# Altium schematic sheet 04_excitation.SchDoc
size A3; SheetNumber: 16; SheetTotal: 17
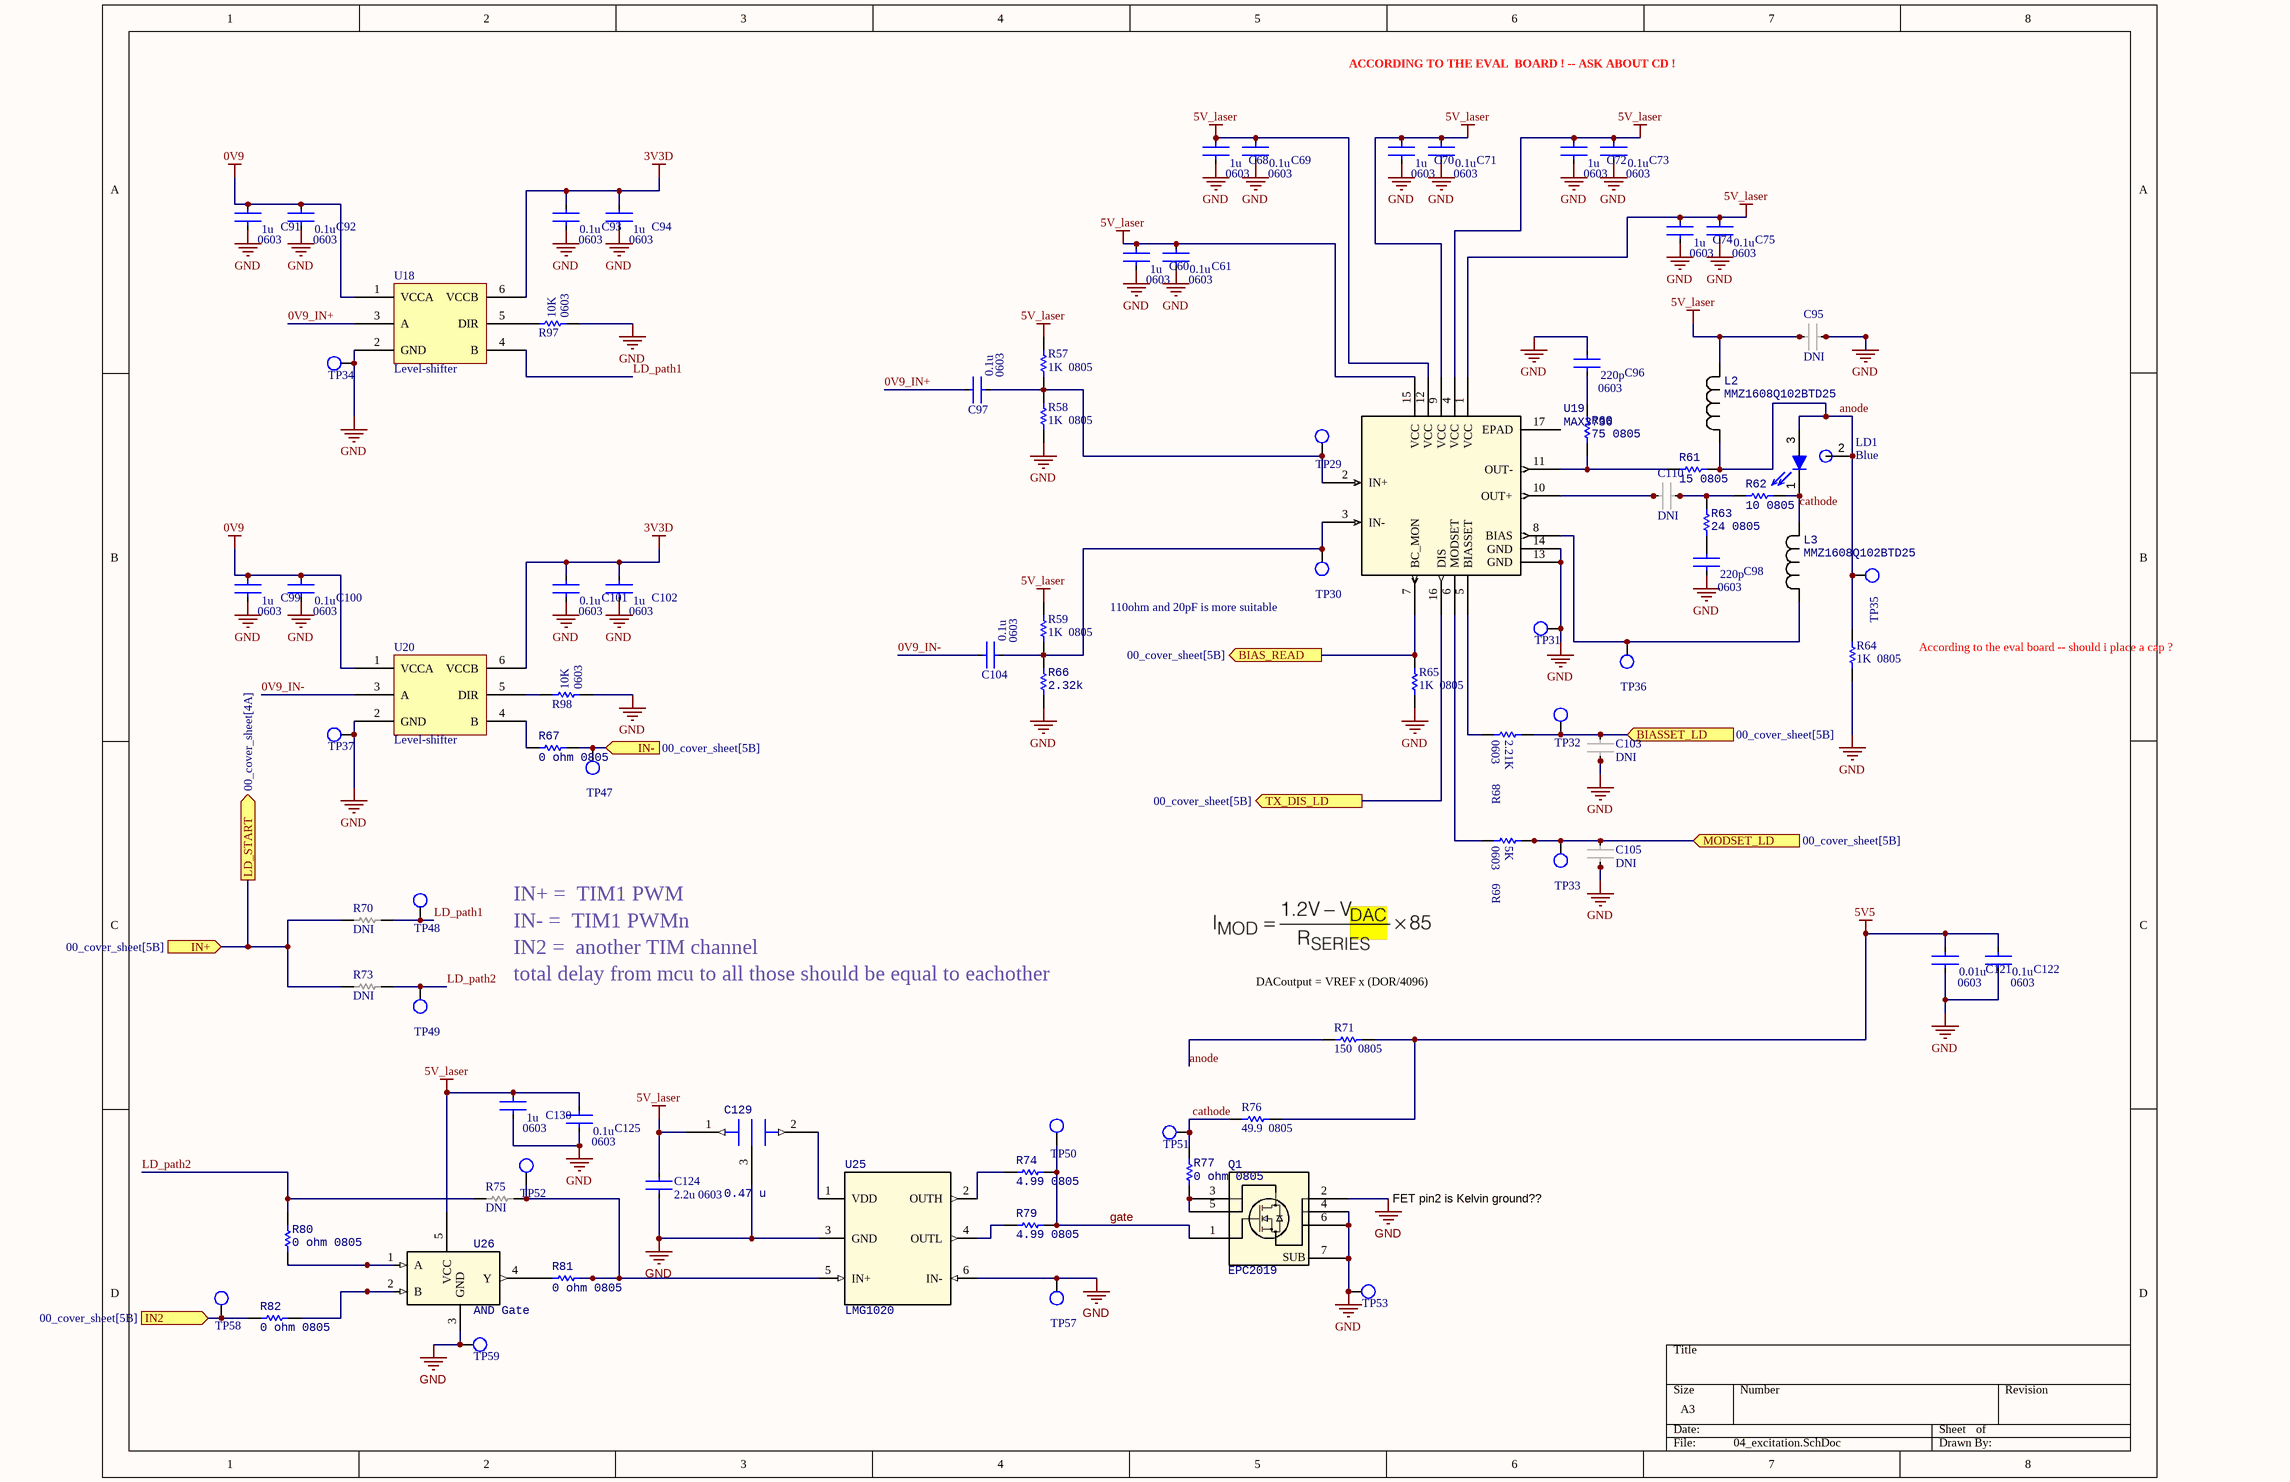
[diagram p0: 04_excitation.SchDoc]

## Parts
C60  C1608X5R1E105K080AC  [CAPTDK0603]  (value not drawn)
C61  CGA3E2X7R1H104K080AA  [CAPTDK0603]  (value not drawn)
C68  C1608X5R1E105K080AC  [CAPTDK0603]  (value not drawn)
C69  CGA3E2X7R1H104K080AA  [CAPTDK0603]  (value not drawn)
C70  C1608X5R1E105K080AC  [CAPTDK0603]  (value not drawn)
C71  CGA3E2X7R1H104K080AA  [CAPTDK0603]  (value not drawn)
C72  C1608X5R1E105K080AC  [CAPTDK0603]  (value not drawn)
C73  CGA3E2X7R1H104K080AA  [CAPTDK0603]  (value not drawn)
C74  C1608X5R1E105K080AC  [CAPTDK0603]  (value not drawn)
C75  CGA3E2X7R1H104K080AA  [CAPTDK0603]  (value not drawn)
C91  C1608X5R1E105K080AC  [CAPTDK0603]  (value not drawn)
C92  CGA3E2X7R1H104K080AA  [CAPTDK0603]  (value not drawn)
C93  CGA3E2X7R1H104K080AA  [CAPTDK0603]  (value not drawn)
C94  C1608X5R1E105K080AC  [CAPTDK0603]  (value not drawn)
C95  DNI  [CAPTDK0603]  (no BOM)
C96  C0603C221K5RAC7867  [CAPTDK0603]  (value not drawn)
C97  CGA3E2X7R1H104K080AA  [CAPTDK0603]  (value not drawn)
C98  C0603C221K5RAC7867  [CAPTDK0603]  (value not drawn)
C99  C1608X5R1E105K080AC  [CAPTDK0603]  (value not drawn)
C100  CGA3E2X7R1H104K080AA  [CAPTDK0603]  (value not drawn)
C101  CGA3E2X7R1H104K080AA  [CAPTDK0603]  (value not drawn)
C102  C1608X5R1E105K080AC  [CAPTDK0603]  (value not drawn)
C103  DNI  [CAPTDK0603]  (no BOM)
C104  CGA3E2X7R1H104K080AA  [CAPTDK0603]  (value not drawn)
C105  DNI  [CAPTDK0603]  (no BOM)
C110  DNI  [CAPTDK0603]  (no BOM)
C121  C0603C103J5RACTU  [CAPTDK0603]  (value not drawn)
C122  CGA3E2X7R1H104K080AA  [CAPTDK0603]  (value not drawn)
C124  2.2u 0603  [CAPTDK0603]
C125  CGA3E2X7R1H104K080AA  [CAPTDK0603]  (value not drawn)
C129  0.47 u  [YFF18PW]
C130  C1608X5R1E105K080AC  [CAPTDK0603]  (value not drawn)
L2  MMZ1608Q102BTD25  [IND_TDK_MMZ1608_TDK]
L3  MMZ1608Q102BTD25  [IND_TDK_MMZ1608_TDK]
LD1  Blue  [LS56HBSM1]
Q1  EPC2019  [EPC2019_ECC]
R57  1K  0805  [RES-STACK-POLE-0805]
R58  1K  0805  [RES-STACK-POLE-0805]
R59  1K  0805  [RES-STACK-POLE-0805]
R60  75 0805  [RES-STACK-POLE-0805]
R61  15 0805  [RES-STACK-POLE-0805]
R62  10 0805  [RES-STACK-POLE-0805]
R63  24 0805  [RES-STACK-POLE-0805]
R64  1K  0805  [RES-STACK-POLE-0805]
R65  1K  0805  [RES-STACK-POLE-0805]
R66  2.32k  [RES-STACK-POLE-0805]
R67  0 ohm 0805  [RES-STACK-POLE-0805]
R68  RMCF0603FT2K21  [RES-STACK-POLE-0603]  (value not drawn)
R69  RT0603BRE075KL  [RES-STACK-POLE-0603]  (value not drawn)
R70  DNI  [RES-STACK-POLE-0805]
R71  150  0805  [RES-STACK-POLE-0805]
R73  DNI  [RES-STACK-POLE-0805]
R74  4.99 0805  [RES-STACK-POLE-0805]
R75  DNI  [RES-STACK-POLE-0805]
R76  49.9  0805  [RES-STACK-POLE-0805]
R77  0 ohm 0805  [RES-STACK-POLE-0805]
R79  4.99 0805  [RES-STACK-POLE-0805]
R80  0 ohm 0805  [RES-STACK-POLE-0805]
R81  0 ohm 0805  [RES-STACK-POLE-0805]
R82  0 ohm 0805  [RES-STACK-POLE-0805]
R97  RMCF0603JG10K0  [RES-STACK-POLE-0603]  (value not drawn)
R98  RMCF0603JG10K0  [RES-STACK-POLE-0603]  (value not drawn)
TP29  TESTPOINT_S  [TESTPOINT_S]  (value not drawn)  (no BOM)
TP30  TESTPOINT_S  [TESTPOINT_S]  (value not drawn)  (no BOM)
TP31  TESTPOINT_S  [TESTPOINT_S]  (value not drawn)  (no BOM)
TP32  TESTPOINT_S  [TESTPOINT_S]  (value not drawn)  (no BOM)
TP33  TESTPOINT_S  [TESTPOINT_S]  (value not drawn)  (no BOM)
TP34  TESTPOINT_S  [TESTPOINT_S]  (value not drawn)  (no BOM)
TP35  TESTPOINT_S  [TESTPOINT_S]  (value not drawn)  (no BOM)
TP36  TESTPOINT_S  [TESTPOINT_S]  (value not drawn)  (no BOM)
TP37  TESTPOINT_S  [TESTPOINT_S]  (value not drawn)  (no BOM)
TP47  TESTPOINT_S  [TESTPOINT_S]  (value not drawn)  (no BOM)
TP48  TESTPOINT_S  [TESTPOINT_S]  (value not drawn)  (no BOM)
TP49  TESTPOINT_S  [TESTPOINT_S]  (value not drawn)  (no BOM)
TP50  TESTPOINT_S  [TESTPOINT_S]  (value not drawn)  (no BOM)
TP51  TESTPOINT_S  [TESTPOINT_S]  (value not drawn)  (no BOM)
TP52  TESTPOINT_S  [TESTPOINT_S]  (value not drawn)  (no BOM)
TP53  TESTPOINT_S  [TESTPOINT_S]  (value not drawn)  (no BOM)
TP57  TESTPOINT_S  [TESTPOINT_S]  (value not drawn)  (no BOM)
TP58  TESTPOINT_S  [TESTPOINT_S]  (value not drawn)  (no BOM)
TP59  TESTPOINT_S  [TESTPOINT_S]  (value not drawn)  (no BOM)
U18  Level-shifter  [SON50P100X60-6N]
U19  MAX3736  [16-TQFN-EP]
U20  Level-shifter  [SON50P100X60-6N]
U25  LMG1020  [YFF0006AEAE]
U26  AND Gate  [SOT-1.1]

## Ports
BIAS_READ (out, see 00_cover_sheet[5B]), BIASSET_LD (in, see 00_cover_sheet[5B]), IN2 (in, see 00_cover_sheet[5B]), IN+ (in, see 00_cover_sheet[5B]), IN- (in, see 00_cover_sheet[5B]), LD_START (out, see 00_cover_sheet[4A]), MODSET_LD (in, see 00_cover_sheet[5B]), TX_DIS_LD (out, see 00_cover_sheet[5B])

## Nets
0V9: C91.1 C92.1 C99.1 C100.1 U18.1(VCCA) U20.1(VCCA)
3V3D: C93.1 C94.1 C101.1 C102.1 U18.6(VCCB) U20.6(VCCB)
5V5: C121.1 C122.1 R71.2 R76.2
5V_laser: C60.1 C61.1 C68.1 C69.1 C70.1 C71.1 C72.1 C73.1 C74.1 C75.1 C95.1 C124.1 C125.1 C129.1(IN/OUT) C130.1 L2.1 R57.2 R59.2 U19.1(VCC) U19.4(VCC) U19.9(VCC) U19.12(VCC) U19.15(VCC) U26.5(VCC)
GND: C60.2 C61.2 C68.2 C69.2 C70.2 C71.2 C72.2 C73.2 C74.2 C75.2 C91.2 C92.2 C93.2 C94.2 C95.2 C96.1 C98.2 C99.2 C100.2 C101.2 C102.2 C103.2 C105.2 C121.2 C122.2 C124.2 C125.2 C129.3(GND) C130.2 Q1.2 Q1.4 Q1.6 Q1.7 R58.1 R64.1 R65.1 R66.1 R97.1 R98.1 TP31.1 TP34.1 TP37.1 TP53.1 TP57.1 TP59.1 U18.2(GND) U19.13(GND) U19.14(GND) U20.2(GND) U25.3(GND) U25.6(IN-) U26.3(GND)
0V9_IN+: C97.1 U18.3(A)
0V9_IN-: C104.1 U20.3(A)
anode: L2.2 LD1.2 LD1.3 R61.2 R64.2 R71.1 TP35.1
BIAS_READ: R65.2 U19.7(BC_MON) ; port BIAS_READ
BIASSET_LD: C103.1 R68.2 TP32.1 ; port BIASSET_LD
cathode: L3.1 LD1.1 R62.2 R76.1 R77.2 TP51.1
gate: Q1.1 R74.2 R79.2 TP50.1
IN2: R82.1 TP58.1 ; port IN2
IN+: R70.1 R73.1 ; port IN+, port LD_START
IN-: R67.2 TP47.1 ; port IN-
LD_path1: R70.2 TP48.1 U18.4(B)
LD_path2: R73.2 R75.1 R80.2 TP49.1
MODSET_LD: C105.1 R69.2 TP33.1 ; port MODSET_LD
TX_DIS_LD: U19.16(DIS) ; port TX_DIS_LD
NetC96_2: C96.2 R60.2
NetC97_2: C97.2 R57.1 R58.2 TP29.1 U19.2(IN+)
NetC98_1: C98.1 R63.1
NetC104_2: C104.2 R59.1 R66.2 TP30.1 U19.3(IN-)
NetC110_1: C110.1 U19.10(OUT+)
NetC110_2: C110.2 R62.1 R63.2
NetC129_2: C129.2(OUT/IN) U25.1(VDD)
NetL3_2: L3.2 TP36.1 U19.8(BIAS)
NetQ1_3: Q1.3 Q1.5 R77.1
NetR60_1: R60.1 R61.1 U19.11(OUT-)
NetR67_1: R67.1 U20.4(B)
NetR68_1: R68.1 U19.5(BIASSET)
NetR69_1: R69.1 U19.6(MODSET)
NetR74_1: R74.1 U25.2(OUTH)
NetR75_2: R75.2 R81.2 TP52.1 U25.5(IN+)
NetR79_1: R79.1 U25.4(OUTL)
NetR80_1: R80.1 U26.1(A)
NetR81_1: R81.1 U26.4(Y)
NetR82_2: R82.2 U26.2(B)
NetR97_2: R97.2 U18.5(DIR)
NetR98_2: R98.2 U20.5(DIR)

Not connected (* = marked no-connect by the designer): U19 17(EPAD)

## Notes on the sheet
- ACCORDING TO THE EVAL  BOARD ! -- ASK ABOUT CD !
- 110ohm and 20pF is more suitable
- According to the eval board -- should i place a cap ?
- IN+ =  TIM1 PWM
- IN- =  TIM1 PWMn
- IN2 =  another TIM channel
- total delay from mcu to all those should be equal to eachother
- (near R71) DACoutput = VREF x (DOR/4096)
- FET pin2 is Kelvin ground??
- (in symbol C0603C103J5RACTU) 0.01u; 0603
- (in symbol C0603C221K5RAC7867) 220p; 0603
- (in symbol C1608X5R1E105K080AC) 1u; 0603
- (in symbol CGA3E2X7R1H104K080AA) 0.1u; 0603
- (in symbol EPC2019) SUB
- (in symbol RMCF0603FT2K21) 0603; 2.21K
- (in symbol RMCF0603JG10K0) 10K; 0603
- (in symbol RT0603BRE075KL) 0603; 5K

## Library data of the parts
C60 C68 C70 C72 C74 C91 C94 C99 C102 C130 = C1608X5R1E105K080AC: CAP CER 1UF 25V X5R 0603; Supplier 1: Digi-Key; Supplier Part Number 1: 445-5146-1-ND
C61 C69 C71 C73 C75 C92 C93 C97 C100 C101 C104 C122 C125 = CGA3E2X7R1H104K080AA: CAP CER 0.1UF 50V X7R 0603; Supplier 1: Digi-Key; Supplier Part Number 1: 445-5666-1-ND
C95 C103 C105 C110 = C0402_PROVISION: CAP PROVISION 0603; Value: DNI
C96 C98 = C0603C221K5RAC7867: CAP CER 220PF 50V X7R 0603; Supplier 1: Digikey; Supplier Part Number 1: 399-C0603C221K5RAC7867CT-ND
C121 = C0603C103J5RACTU: CAP CER 10000PF 50V X7R 0603; Supplier 1: Digikey; Supplier Part Number 1: 399-C0603C103J5RACTUCT-ND
C124 = CAP2u2: CAP CER 2.2UF 0603; Supplier 1: Digi-Key; Supplier Part Number 1: 445-5146-1-ND
C129 = YFF18PW0J474MT0H0N: YFF18PW0J474MT0H0N CAP FEEDTHRU 0.47UF 6.3V 0603; Supplier 1: Digikey; Supplier Part Number 1: 445-3028-1-ND
L2 L3 = MMZ1608Q102BTD25: FERRITE BEAD 1K OHM 0603 1LN; Supplier 1: Digikey; Supplier Part Number 1: 445-MMZ1608Q102BTD25CT-ND
LD1 = LA_LS56HB: Hyper Blue Laser Diode (450 nm), Single Modeligh tavenue / - 80 mW optical power / - Low threshold / - 5.6 mm TO package / - Medium power; Supplier 1: Light Avenue; Supplier Part Number 1: LA_LS56HB
Q1 = EPC2019: GANFET N-CH 200V 8.5A DIE N-Channel 200 V 8.5A (Ta) Surface Mount Die; Supplier 1: Digikey; Supplier Part Number 1: 917-1087-1-ND
R57-R59 R64 = RK73H2ATTD1001F: RES 1K OHM 1% 1/4W 0805; Supplier 1: Digikey; Supplier Part Number 1: 2019-RK73H2ATTD1001FCT-ND
R60 = RK73H2ATTD75R0F: RES 75 OHM 1% 1/4W 0805; Supplier 1: Digikey; Supplier Part Number 1: 2019-RK73H2ATTD75R0FCT-ND
R61 = RK73H2ATTD15R0F: RES 15 OHM 1% 1/4W 0805; Supplier 1: Digikey; Supplier Part Number 1: 2019-RK73H2ATTD15R0FCT-ND
R62 = RK73H2ATTD10R0F: RES 10 OHM 1% 1/4W 0805; Supplier 1: Digikey; Supplier Part Number 1: 2019-RK73H2ATTD10R0FCT-ND
R63 = RK73H2ATTD24R0F: RES 24 OHM 1% 1/4W 0805; Supplier 1: Digikey; Supplier Part Number 1: 2019-RK73H2ATTD24R0FCT-ND
R65 = RK73H2AT1001F: RK73H2ATK001KIT %1 tolerance resistors 0805
R66 = RK73H2ATTD2321F: RES 2.32K OHM 1% 1/4W 0805; Supplier 1: Digikey; Supplier Part Number 1: 541-2.32KHCT-ND
R67 R77 R80-R82 = RC0805JR-070RL: RES 0 OHM JUMPER 1/8W 0805; Supplier 1: Digikey; Supplier Part Number 1: 311-0.0ARCT-ND
R68 = RMCF0603FT2K21: RES 2.21K OHM 0.1% 1/10W 0603; Supplier 1: Digikey; Supplier Part Number 1: RMCF0603FT2K21CT-ND
R69 = RT0603BRE075KL: RES 5K OHM 0.1% 1/10W 0603; Supplier 1: Digikey; Supplier Part Number 1: 13-RT0603BRE075KLCT-ND
R70 R73 R75 = R0805: RES DNI 0805
R71 = RK73H2ATTD1500F: RES 150 OHM 1% 1/4W 0805; Supplier 1: Digikey; Supplier Part Number 1: 2019-RK73H2ATTD1500FCT-ND
R74 R79 = RK73H2ATTD4R99F: RES 4.99 OHM 1% 1/4W 0805; Supplier 1: Digikey; Supplier Part Number 1: 2019-RK73H2ATTD4R99FCT-ND
R76 = RK73H2ATTD49R9F: RES 49.9 OHM 1% 1/4W 0805; Supplier 1: Digikey; Supplier Part Number 1: 2019-RK73H2ATTD49R9FCT-ND
R97 R98 = RMCF0603JG10K0: RES 10K OHM 5% 1/10W 0603; Supplier 1: Digi-Key; Supplier Part Number 1: 738-RMCF0603JG10K0CT-ND
TP29-TP37 TP47-TP53 TP57-TP59 = TESTPOINT_S: Testpoint Surface Pad
U18 U20 = SN74AXCH1T45DRY2: IC TRANSLTR BIDIRECTIONAL 6SON SN74AXCH1T45DRY2 texas instruments; Supplier 1: Digikey; Supplier Part Number 1: 296-SN74AXCH1T45DRY2CT-ND
U19 = MAX3736: IC LASER DRVR 3.2GB 3.63V 16TQFN; Supplier 1: Digikey; Supplier Part Number 1: 175-MAX3736ETE+TCT-ND
U25 = LMG1020YFFR: IC GATE DRVR LOW-SIDE 6DSBGA; Supplier 1: Digikey; Supplier Part Number 1: 296-50208-1-ND
U26 = SN74LVC1G08DCKR: IC GATE AND 1CH 2-INP SC70-5; Supplier 1: Digikey; Supplier Part Number 1: 296-35941-1-ND